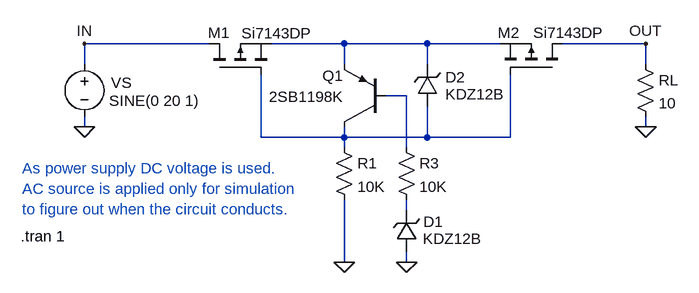
[diagram p0: schematic supply-protection.asc]
supply-protection.asc, the LTspice schematic file:
Version 4
SHEET 1 1012 680
WIRE 48 112 -144 112
WIRE 256 112 144 112
WIRE 384 112 256 112
WIRE 496 112 384 112
WIRE 720 112 592 112
WIRE -144 144 -144 112
WIRE 256 144 256 112
WIRE 384 144 384 112
WIRE 720 144 720 112
WIRE 352 192 320 192
WIRE -144 240 -144 224
WIRE 720 240 720 224
WIRE 128 256 128 160
WIRE 256 256 256 240
WIRE 256 256 128 256
WIRE 384 256 384 208
WIRE 384 256 256 256
WIRE 512 256 512 160
WIRE 512 256 384 256
WIRE 256 272 256 256
WIRE 352 272 352 192
WIRE 352 368 352 352
WIRE 256 448 256 352
WIRE 352 448 352 432
FLAG 256 448 0
FLAG 720 240 0
FLAG -144 240 0
FLAG 352 448 0
FLAG 720 112 OUT
FLAG -144 112 IN
SYMBOL res 704 128 R0
SYMATTR InstName RL
SYMATTR Value 10
SYMBOL voltage -144 128 R0
WINDOW 0 41 44 Left 2
WINDOW 3 38 72 Left 2
WINDOW 123 0 0 Left 0
WINDOW 39 0 0 Left 0
SYMATTR InstName VS
SYMATTR Value SINE(0 20 1)
SYMBOL pmos 48 160 R270
WINDOW 0 65 32 VLeft 2
WINDOW 3 64 50 VRight 2
SYMATTR InstName M1
SYMATTR Value Si7143DP
SYMBOL pmos 592 160 M270
WINDOW 0 65 66 VRight 2
WINDOW 3 65 45 VLeft 2
SYMATTR InstName M2
SYMATTR Value Si7143DP
SYMBOL pnp 320 240 R180
WINDOW 0 65 79 Left 2
WINDOW 3 65 46 Left 2
SYMATTR InstName Q1
SYMATTR Value 2SB1198K
SYMBOL res 240 256 R0
SYMATTR InstName R1
SYMATTR Value 10K
SYMBOL zener 368 432 R180
WINDOW 0 -10 46 Right 2
WINDOW 3 -9 20 Right 2
SYMATTR InstName D1
SYMATTR Value KDZ12B
SYMATTR Description Diode
SYMATTR Type diode
SYMBOL res 336 256 R0
SYMATTR InstName R3
SYMATTR Value 10K
SYMBOL zener 400 208 R180
WINDOW 0 -12 44 Right 2
WINDOW 3 -12 18 Right 2
SYMATTR InstName D2
SYMATTR Value KDZ12B
SYMATTR Description Diode
SYMATTR Type diode
TEXT -242 408 Left 2 !.tran 1
TEXT -240 304 Left 2 ;As power supply DC voltage is used.\nAC source is applied only for simulation\nto figure out when the circuit conducts.

The netlist it stands for:
* supply-protection.asc
RL OUT 0 10
VS IN 0 SINE(0 20 1)
M1 IN N003 N001 N001 Si7143DP
M2 OUT N003 N001 N001 Si7143DP
Q1 N003 N002 N001 0 2SB1198K
R1 N003 0 10K
D1 0 N004 KDZ12B
R3 N002 N004 10K
D2 N003 N001 KDZ12B
.model D D
.lib standard.dio
.model NPN NPN
.model PNP PNP
.lib standard.bjt
.model NMOS NMOS
.model PMOS PMOS
.lib standard.mos
.tran 1
* As power supply DC voltage is used.
* AC source is applied only for simulation
* to figure out when the circuit conducts.
.backanno
.end